# EAGLE design power_injector_rev_a (EAGLE 5.11)
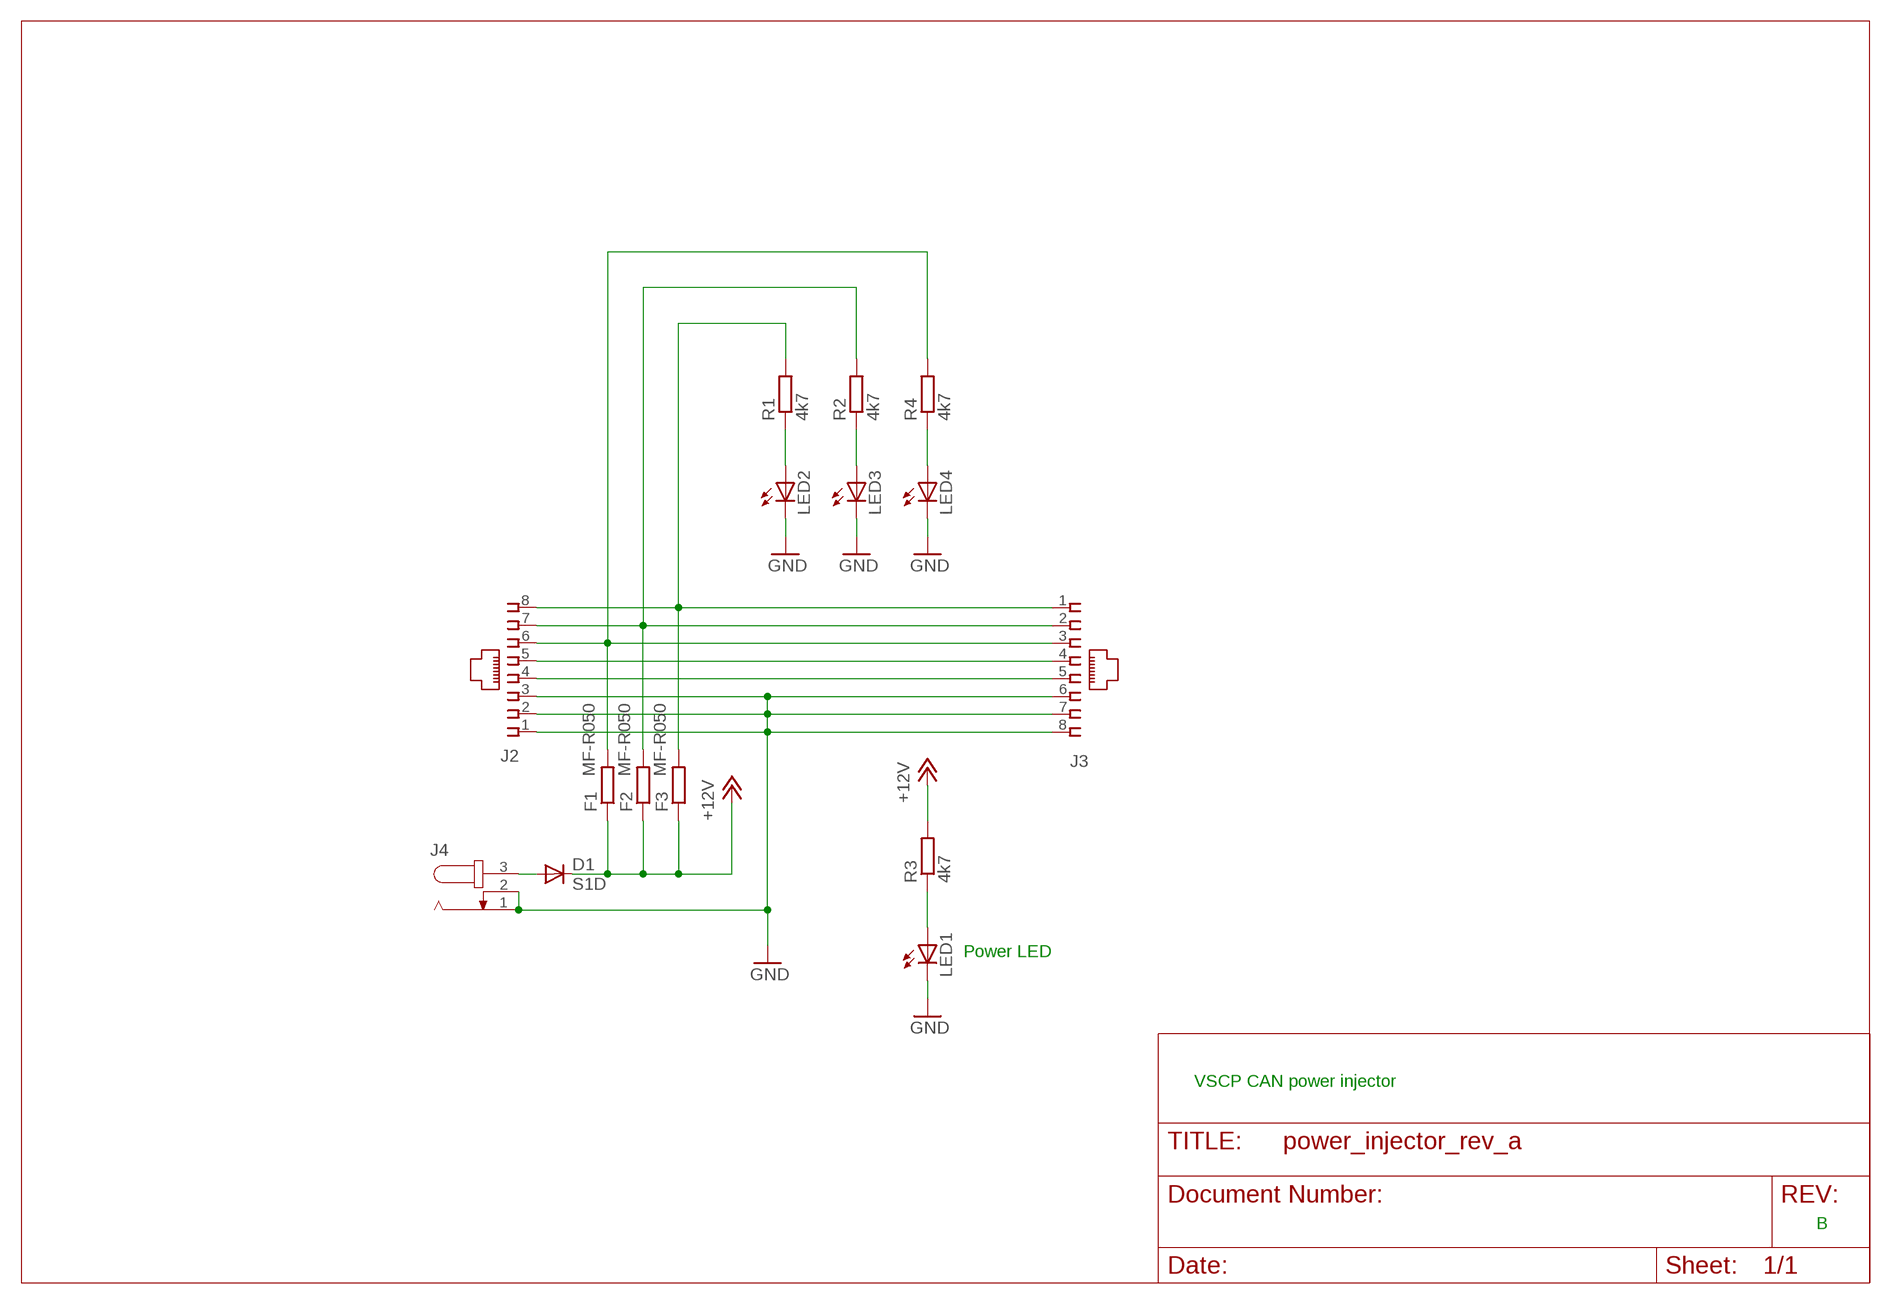
[diagram p0: schematic, sheet 1]

## Parts
D1  S1D  DIODE-SMB  [SMB]
F1  MF-R050  R-EU_0204/5  [0204/5]
F2  MF-R050  R-EU_0204/5  [0204/5]
F3  MF-R050  R-EU_0204/5  [0204/5]
J2  A00-108-220-450  [RJ-45]
J3  A00-108-220-450  [RJ-45]
J4  JACK-PLUG0  [SPC4077]
LED1  LEDCHIP-LED0805  [CHIP-LED0805]
LED2  LEDCHIP-LED0805  [CHIP-LED0805]
LED3  LEDCHIP-LED0805  [CHIP-LED0805]
LED4  LEDCHIP-LED0805  [CHIP-LED0805]
R1  4k7  R-EU_R0805  [R0805]
R2  4k7  R-EU_R0805  [R0805]
R3  4k7  R-EU_R0805  [R0805]
R4  4k7  R-EU_R0805  [R0805]

## Nets
+12V: D1.C F1.1 F2.1 F3.1 R3.2
GND: J2.1 J2.2 J2.3 J3.6 J3.7 J3.8 J4.1 J4.2 LED1.C LED2.C LED3.C LED4.C
N$1: LED3.A R2.1
N$2: LED1.A R3.1
N$4: J2.5 J3.4
N$5: J2.4 J3.5
N$6: LED4.A R4.1
N$7: LED2.A R1.1
N$8: D1.A J4.3
PWR1: F3.2 J2.8 J3.1 R1.2
PWR2: F2.2 J2.7 J3.2 R2.2
PWR3: F1.2 J2.6 J3.3 R4.2

## Notes on the sheet
- Power LED
- VSCP CAN power injector
- B

## Library data of the parts
D1 = diode:DIODE-: DIODE
F1-F3 R1-R4 = rcl:R-EU_: RESISTOR, European symbol
J2 J3 = vscpcan:A00-108-220-450
J4 = con-jack-special:JACK-PLUG: DC POWER JACK Power Jack, DC, Right Angle, Through Hole, Rated 5A at 16VDC, PC Terminals Distributor: Farnell (www.Farnell.de) Drawing: 84N1161.pdf / 84N1162.pdf Manufacturer: SPC Technology (www.spctechnology.com) Type: SPC4077 / SPC 4078; OC_FARNELL: unknown; OC_NEWARK: unknown
LED1-LED4 = led:LED: LED OSRAM: - CHIPLED LG R971, LG N971, LY N971, LG Q971, LY Q971, LO R971, LY R971 LH N974, LH R974 LS Q976, LO Q976, LY Q976 LO Q996 - Hyper CHIPLED LW Q18S LB Q993, LB Q99A, LB R99A - SideLED LS A670, LO A670, LY A670, LG A670, LP A670 LB A673, LV A673, LT A673, LW A673 LH A674 LY A675 LS A676, LA A676, LO A676, LY A676, LW A676 LS A679, LY A679, LG A679 - Hyper Micro SIDELED® LS Y876, LA Y876, LO Y876, LY Y876 LT Y87S - SmartLED LW L88C, LW L88S LB L89C, LB L89S, LG L890 LS L89K, LO L89K, LY L89K LS L896, LA L896, LO L896, LY L896 - TOPLED LS T670, LO T670, LY T670, LG T670, LP T670 LSG T670, LSP T670, LSY T670, LOP T670, LYG T670 LG T671, LOG T671, LSG T671 LB T673, LV T673, LT T673, LW T673 LH T674 LS T676, LA T676, LO T676, LY T676, LB T676, LH T676, LSB T676, LW T676 LB T67C, LV T67C, LT T67C, LS T67K, LO T67K, LY T67K, LW E67C LS E67B, LA E67B, LO E67B, LY E67B, LB E67C, LV E67C, LT E67C LW T67C LS T679, LY T679, LG T679 LS T770, LO T770, LY T770, LG T770, LP T770 LB T773, LV T773, LT T773, LW T773 LH T774 LS E675, LA E675, LY E675, LS T675 LS T776, LA T776, LO T776, LY T776, LB T776 LHGB T686 LT T68C, LB T68C - Hyper Mini TOPLED® LB M676 - Mini TOPLED Santana® LG M470 LS M47K, LO M47K, LY M47K Source: http://www.osram.convergy.de LUXEON: - LUMILED® LXK2-PW12-R00, LXK2-PW12-S00, LXK2-PW14-U00, LXK2-PW14-V00 LXK2-PM12-R00, LXK2-PM12-S00, LXK2-PM14-U00 LXK2-PE12-Q00, LXK2-PE12-R00, LXK2-PE12-S00, LXK2-PE14-T00, LXK2-PE14-U00 LXK2-PB12-K00, LXK2-PB12-L00, LXK2-PB12-M00, LXK2-PB14-N00, LXK2-PB14-P00, LXK2-PB14-Q00 LXK2-PR12-L00, LXK2-PR12-M00, LXK2-PR14-Q00, LXK2-PR14-R00 LXK2-PD12-Q00, LXK2-PD12-R00, LXK2-PD12-S00 LXK2-PH12-R00, LXK2-PH12-S00 LXK2-PL12-P00, LXK2-PL12-Q00, LXK2-PL12-R00 Source: www.luxeon.com KINGBRIGHT: KA-3528ASYC Source: www.kingbright.com

## Board
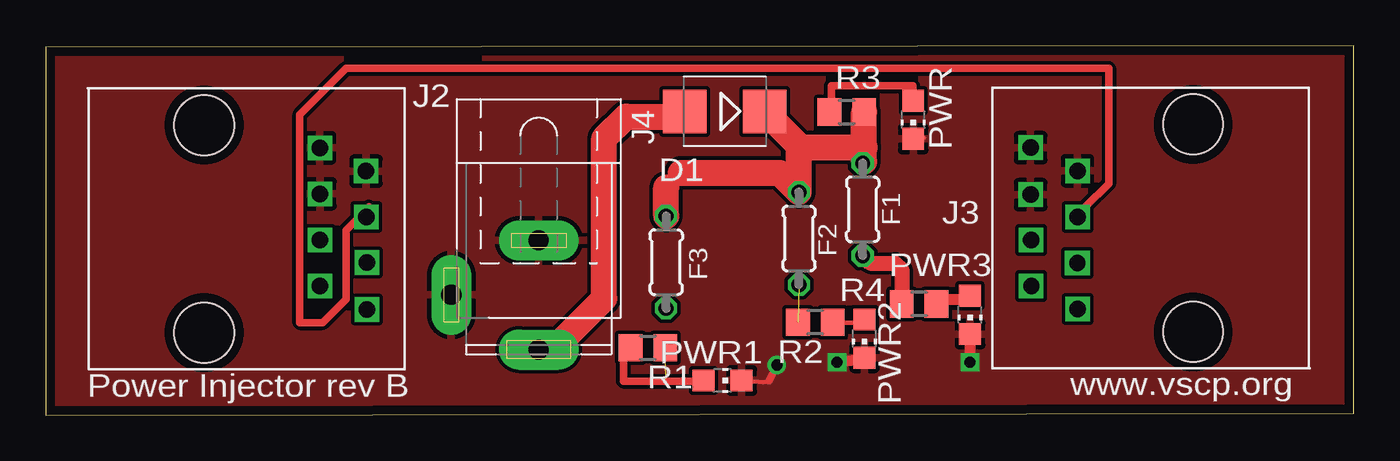
[diagram p1: board, top side]
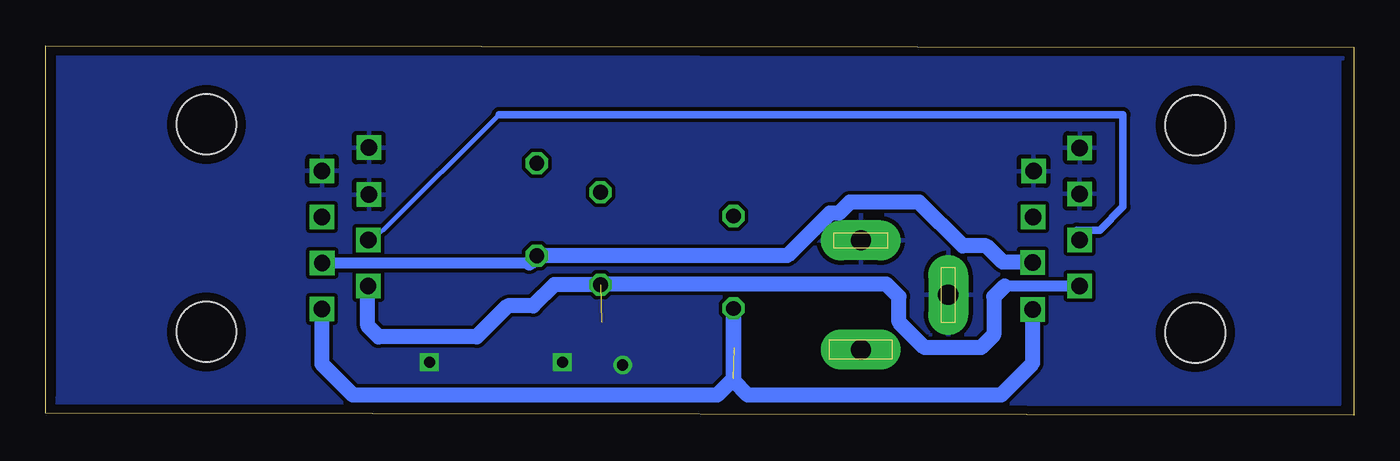
[diagram p2: board, bottom side, seen from below]

Size 71.9 x 20.3 mm. Coordinates in mm from the lower left corner, seen from the top.
Outline: 0,0 71.9,0.1 71.9,20.3 0,20.2 0,0
Copper layers (1*16): Top 0.035mm / dielectric 1.5mm / Bottom 0.035mm
Design rules "8mils": minimum track width 8mil, minimum drill 0.6mm, track to track 8mil, track to pad 8mil, pad to pad 8mil, via to via 8mil, smd to smd 0mil, copper to edge 20mil, drill to drill 10mil, minimum pad ring 8mil, minimum via ring 8mil, stop-mask expansion 0mil, vias tented up to drill 0mil, thermal gap 10mil

### Footprints (pad centres in the part's own frame; a part is rotated, then mirrored left to right if it is on the bottom)
SMB = smd 2.4 x 2.4: A 2.2,0; C -2.2,0
0204/5 = drill 0.813 octagon: 1 -2.54,0; 2 2.54,0
RJ-45 = drill 0.9 square: 1 -4.45,6.35; 2 -3.17,8.89; 3 -1.92,6.36; 4 -0.65,8.91; 5 0.62,6.35; 6 1.84,8.93; 7 3.14,6.35; 8 4.42,8.93 | hole 3.3: -5.7,0; 5.7,0
SPC4077 = drill 1.1 pad 2.184 long: 1 -3,0; 2 0,-4.8; 3 3,0
CHIP-LED0805 = smd 1.2 x 1.2: A 0,-1.05; C 0,1.05
R0805 = smd 1.3 x 1.5: 1 -0.95,0; 2 0.95,0

### Placement (x,y rotation side)
D1  37.32,16.68 180 top
F1  44.9,11.3 270 top
F2  41.4,9.7 270 top
F3  34.1,8.4 270 top
J2  8.72,10.23 270 top
J3  63.06,10.27 90 top
J4  27.1,6.6 270 top
LED1  47.68,16.22 180 top
LED2  37.2,1.9 270 top
LED3  45,4.2 180 top
LED4  50.8,5.5 180 top
R1  33.1,3.7 0 top
R2  42.3,5.1 180 top
R3  44.03,16.65 0 top
R4  48,6.1 180 top

### Tracks (layer width: path | path; a pad name or v marks a point on that pad's centre or on a via)
+12V
  Top 0.813: 34.1,12.5 34.9,13.3 | 44.98,13.92 F1.1 44.9,14.6 45,14.7 | 41.4,14.8 41.5,14.7
  Top 1.422: F3.1 34.1,12.5 | 34.9,13.3 40.34,13.3 F2.1 41.4,14.8 D1.C | 44.98,13.92 R3.2 | 41.5,14.7 45,14.7
GND  (via drill 0.6, 0.61)
  Top 0.254: LED1.C 48.26,15.24 | 39.76,1.88 39.46,1.81 LED2.C
  Top 0.406: 39.76,1.88 v40.19,2.75
  Top 0.61: v43.5,2.9 44.55,3 LED3.C | LED4.C v50.8,2.9
  pour Bottom: 0.6,19.6 0.8,19.6 0.8,0.6 71.3,0.6 71.3,0.9 71.2,0.9 71.2,19.7 0.9,19.7
  pour Top: 0.4,19.9 0.4,0.4 0.6,0.2 71.2,0.2 71.8,0.8 71.8,19.4 71.2,20
N$1
  Top 0.254: LED3.A 44.45,5.08 43.18,5.08 R2.1
N$2
  Top 0.254: R3.1 43.18,16.51
  Top 0.406: 43.18,16.51 43.18,18.08 47.66,18.08 LED1.A
N$4
  Bottom 0.254: 46.99,16.51 53.34,10.16 54.01,9.66 J3.4
  Bottom 0.406: 46.99,16.51 12.7,16.51 12.7,11.43 13.97,10.16 15.24,10.16 J2.5
N$5
  Top 0.406: J2.4 17.78,11.43 16.51,10.16 16.51,6.35 15.24,5.08 13.97,5.08 13.97,16.51 16.51,19.05 58.42,19.05 58.42,12.7 57.15,11.43 J3.5
N$6
  Top 0.254: 50.8,6.35 LED4.A | R4.1 49.53,6.35
  Top 0.61: 49.53,6.35 50.8,6.35
N$7
  Top 0.254: 35.56,1.87 LED2.A | 31.75,3.81 R1.1
  Top 0.406: 35.56,1.87 31.75,1.87 31.75,3.81
N$8
  Top 1.422: J4.3 27.9,3.6 30.7,6.4 30.7,15.2 31.9,16.4 34.84,16.4 D1.A
PWR1  (1 unrouted)
  Bottom 0.813: J2.8 17.65,2.85 19.4,1.1 33.3,1.1 34.1,1.9 F3.2 34.1,2 35,1.1 55,1.1 56.7,2.8 J3.1
PWR2  (1 unrouted)
  Bottom 0.61: J2.7 19.21,7.09
  Bottom 0.813: J3.2 54.2,7.07 54.2,4.9 53.6,4.3 48.2,4.3 46.5,6 45.1,6 43.94,7.16 F2.2 41.36,7.2 25.7,7.2 25,6.5 25,5.1 23.6,3.7 20.5,3.7 19.8,4.4 19.8,6.5 19.21,7.09
PWR3
  Top 0.813: R4.2 47.05,8 46.7,8.35 45.31,8.35 F1.2
  Bottom 0.61: 45.31,8.35 J3.3
  Bottom 0.813: 45.31,8.35 F1.2 31.14,8.76 28.8,11.1 28.3,11.1 27.7,11.7 23.9,11.7 21.5,9.3 20.2,9.3 19.3,8.4 J2.6

### Text on the board
tNames: PWR | PWR3 | PWR1 | Power Injector rev B | PWR2 | www.vscp.org